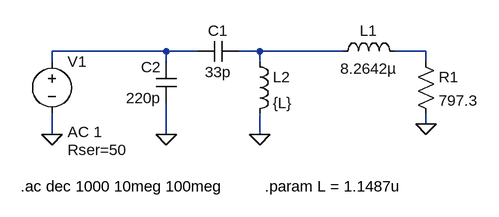
[diagram p0: schematic AcopleAntena.asc]
AcopleAntena.asc, the LTspice schematic file:
Version 4
SHEET 1 880 680
WIRE -64 96 -240 96
WIRE -16 96 -64 96
WIRE 80 96 48 96
WIRE 208 96 80 96
WIRE 336 96 288 96
WIRE -240 112 -240 96
WIRE -64 112 -64 96
WIRE 80 112 80 96
WIRE 336 112 336 96
WIRE 336 208 336 192
WIRE -240 224 -240 192
WIRE -64 224 -64 176
WIRE 80 224 80 192
FLAG 336 208 0
FLAG -64 224 0
FLAG 80 224 0
FLAG -240 224 0
SYMBOL res 320 96 R0
SYMATTR InstName R1
SYMATTR Value 797.3
SYMBOL ind 192 112 R270
WINDOW 0 32 56 VTop 2
WINDOW 3 5 56 VBottom 2
SYMATTR InstName L1
SYMATTR Value 8.2642µ
SYMBOL ind 64 96 R0
SYMATTR InstName L2
SYMATTR Value {L}
SYMATTR SpiceLine Rser={2*pi*L*28837000/80}
SYMBOL cap 48 80 R90
WINDOW 0 0 32 VBottom 2
WINDOW 3 32 32 VTop 2
SYMATTR InstName C1
SYMATTR Value 33p
SYMBOL cap -48 176 R180
WINDOW 0 24 56 Left 2
WINDOW 3 24 8 Left 2
SYMATTR InstName C2
SYMATTR Value 220p
SYMBOL voltage -240 96 R0
WINDOW 123 24 124 Left 2
WINDOW 39 24 152 Left 2
SYMATTR Value2 AC 1
SYMATTR SpiceLine Rser=50
SYMATTR InstName V1
SYMATTR Value ""
TEXT -288 304 Left 2 !.ac dec 1000 10meg 100meg
TEXT 88 304 Left 2 !.param L = 1.1487u

The netlist it stands for:
* AcopleAntena.asc
R1 N003 0 797.3
L1 N002 N003 8.2642µ
L2 N002 0 {L} Rser={2*pi*L*28837000/80}
C1 N002 N001 33p
C2 0 N001 220p
V1 N001 0 AC 1 Rser=50
.ac dec 1000 10meg 100meg
.param L = 1.1487u
.backanno
.end